# EAGLE design mainboard (EAGLE 9.6.2)
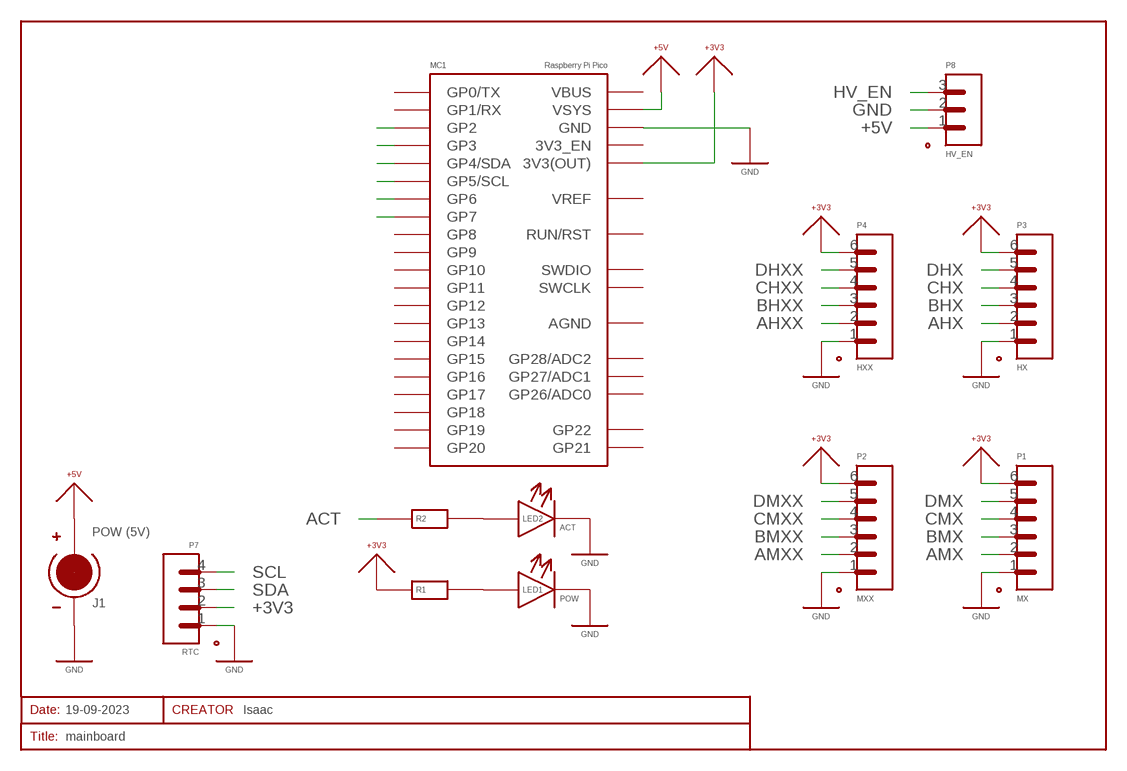
[diagram p0: schematic, sheet 1]

## Parts
CREATOR  Isaac  INFO_T  [INFO_T]
J1  POW (5V)  DC_POWER_CENTER-POS_XH2.54  [XH2.54_2-PIN]
LED1  POW  LED_3MM  [LED_3MM]
LED2  ACT  LED_3MM  [LED_3MM]
MC1  RASPBERRY-PI-PICO_THT  [RASPBERRY-PI-PICO_THT]
P1  MX  PORT_6-PIN_XH2.54  [XH2.54_6-PIN]
P2  MXX  PORT_6-PIN_XH2.54  [XH2.54_6-PIN]
P3  HX  PORT_6-PIN_XH2.54  [XH2.54_6-PIN]
P4  HXX  PORT_6-PIN_XH2.54  [XH2.54_6-PIN]
P7  RTC  PORT_4-PIN_XH2.54  [XH2.54_4-PIN]
P8  HV_EN  PORT_3-PIN_XH2.54  [XH2.54_3-PIN]
R1  RESISTOR  [RESISTOR_10.16MM]
R2  RESISTOR  [RESISTOR_10.16MM]
SCHEMATIC1  19-09-2023  SHEET  [SHEET]

## Nets
+3V3: MC1.36(3V3(OUT)) P1.6 P2.6 P3.6 P4.6 P7.2 R1.1
+5V: J1.2(+) MC1.39(VSYS) P8.1
ACT: R2.1
AHX: P3.2
AHXX: P4.2
AMX: P1.2
AMXX: P2.2
BHX: P3.3
BHXX: P4.3
BMX: P1.3
BMXX: P2.3
CHX: P3.4
CHXX: P4.4
CMX: P1.4
CMXX: P2.4
DHX: P3.5
DHXX: P4.5
DMX: P1.5
DMXX: P2.5
GND: J1.1(GND) LED1.- LED2.- MC1.3(GND) MC1.8(GND) MC1.13(GND) MC1.18(GND) MC1.23(GND) MC1.28(GND) MC1.38(GND) MC1.D_GND(GND) P1.1 P2.1 P3.1 P4.1 P7.1 P8.2
HV_EN: P8.3
N$1: LED1.+ R1.2
N$2: LED2.+ R2.2
N$3: MC1.6(GP4/SDA)
N$4: MC1.7(GP5/SCL)
N$5: MC1.4(GP2)
N$6: MC1.5(GP3)
N$7: MC1.9(GP6)
N$8: MC1.10(GP7)
SCL: P7.4
SDA: P7.3
Unconnected: MC1.1(GP0/TX) MC1.2(GP1/RX) MC1.11(GP8) MC1.12(GP9) MC1.14(GP10) MC1.15(GP11) MC1.16(GP12) MC1.17(GP13) MC1.19(GP14) MC1.20(GP15) MC1.21(GP16) MC1.22(GP17) MC1.24(GP18) MC1.25(GP19) MC1.26(GP20) MC1.27(GP21) MC1.29(GP22) MC1.30(RUN/RST) MC1.31(GP26/ADC0) MC1.32(GP27/ADC1) MC1.34(GP28/ADC2) MC1.35(VREF) MC1.37(3V3_EN) MC1.40(VBUS) MC1.SWCLK MC1.SWDIO

## Power pins joined to a net without a drawn wire
AGND: MC1.33(AGND)

## Library data of the parts
CREATOR = myLibrary:INFO
J1 = myLibrary:DC_POWER_CENTER-POS
LED1 LED2 = myLibrary:LED
MC1 = myLibrary:RASPBERRY-PI-PICO
P1-P4 = myLibrary:PORT_6-PIN
P7 = myLibrary:PORT_4-PIN
P8 = myLibrary:PORT_3-PIN
R1 R2 = myLibrary:RESISTOR
SCHEMATIC1 = myLibrary:SHEET

## Board
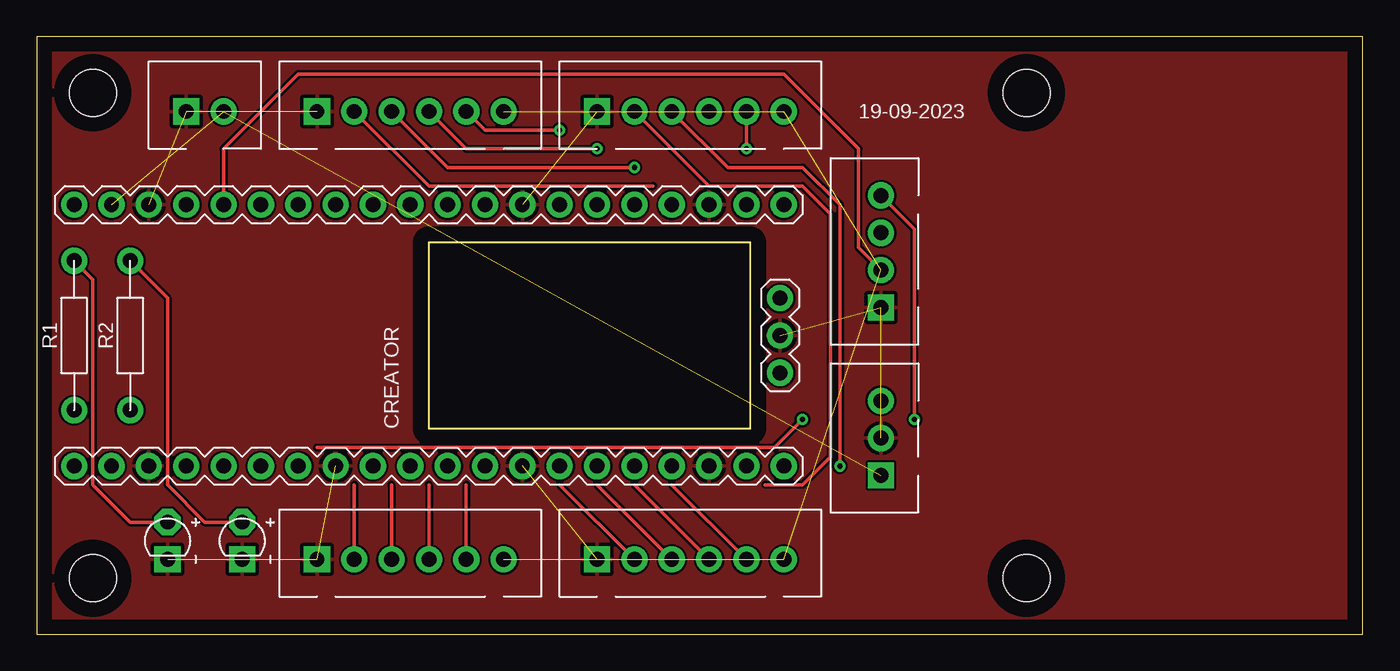
[diagram p1: board, top side]
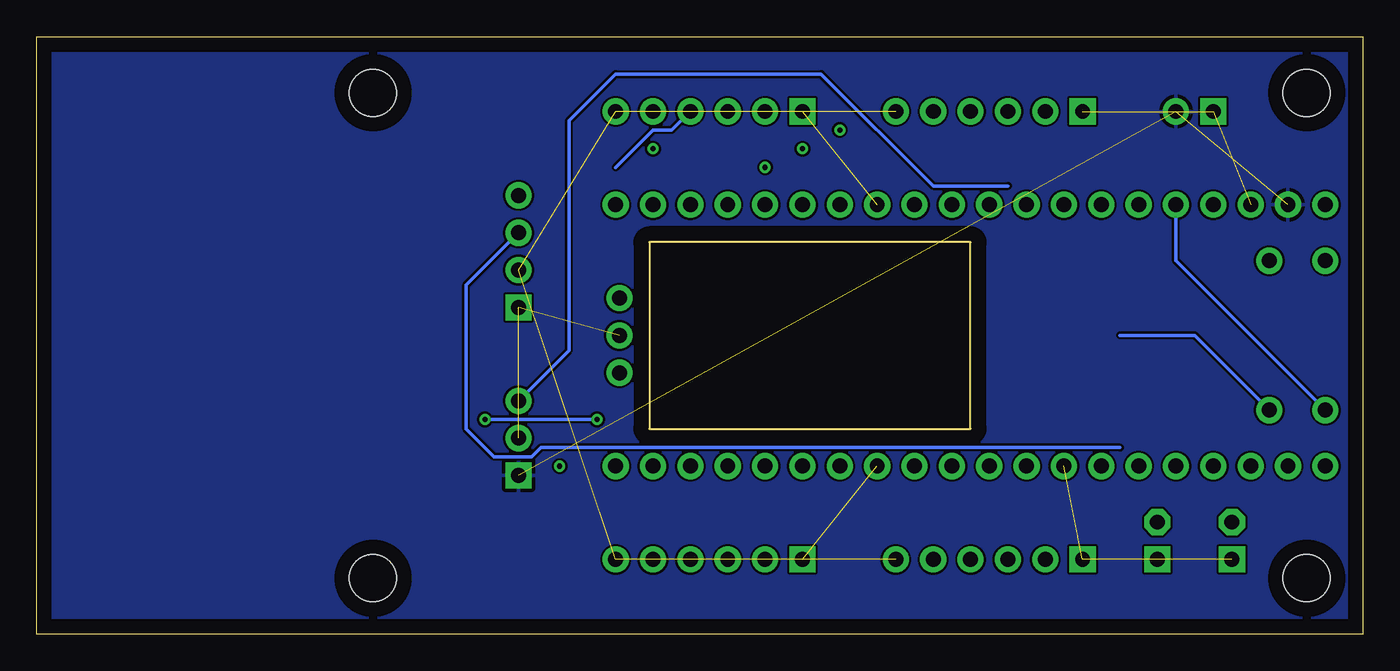
[diagram p2: board, bottom side, seen from below]

Size 90.17 x 40.64 mm. Coordinates in mm from the lower left corner, seen from the top.
Outline: 0,0 90.17,0 90.17,40.64 0,40.64 0,0
Outline: 48.51,26.67 48.51,13.97 26.67,13.97 26.67,26.67 48.51,26.67
Copper layers (1*16): Top 0.035mm / dielectric 1.5mm / Bottom 0.035mm
Design rules "default": minimum track width 6mil, minimum drill 0.35mm, track to track 6mil, track to pad 6mil, pad to pad 6mil, via to via 6mil, smd to smd 6mil, copper to edge 40mil, drill to drill 6mil, minimum pad ring 10mil, minimum via ring 8mil, stop-mask expansion 4mil, vias tented up to drill 0mil, thermal gap 10mil
Holes 3.2 mm at 3.81,36.83 3.81,3.81 67.31,3.81 67.31,36.83

### Footprints (pad centres in the part's own frame; a part is rotated, then mirrored left to right if it is on the bottom)
XH2.54_2-PIN = drill 1.016 pad 1.778 square: 1 -1.27,0 | drill 1.016 pad 1.778: 2 1.27,0
LED_3MM = drill 1.016 pad 1.778 octagon: + -1.27,0 | drill 1.016 pad 1.778 square: - 1.27,0
RASPBERRY-PI-PICO_THT = drill 1.016 pad 1.778: 1 -8.89,24.13; 2 -8.89,21.59; 3 -8.89,19.05; 4 -8.89,16.51; 5 -8.89,13.97; 6 -8.89,11.43; 7 -8.89,8.89; 8 -8.89,6.35; 9 -8.89,3.81; 10 -8.89,1.27; 11 -8.89,-1.27; 12 -8.89,-3.81; 13 -8.89,-6.35; 14 -8.89,-8.89; 15 -8.89,-11.43; 16 -8.89,-13.97; 17 -8.89,-16.51; 18 -8.89,-19.05; 19 -8.89,-21.59; 20 -8.89,-24.13; 21 8.89,-24.13; 22 8.89,-21.59; 23 8.89,-19.05; 24 8.89,-16.51; 25 8.89,-13.97; 26 8.89,-11.43; 27 8.89,-8.89; 28 8.89,-6.35; 29 8.89,-3.81; 30 8.89,-1.27; 31 8.89,1.27; 32 8.89,3.81; 33 8.89,6.35; 34 8.89,8.89; 35 8.89,11.43; 36 8.89,13.97; 37 8.89,16.51; 38 8.89,19.05; 39 8.89,21.59; 40 8.89,24.13; D_GND 0,-23.876; SWCLK -2.54,-23.876; SWDIO 2.54,-23.876
XH2.54_6-PIN = drill 1.016 pad 1.778 square: 1 -6.35,0 | drill 1.016 pad 1.778: 2 -3.81,0; 3 -1.27,0; 4 1.27,0; 5 3.81,0; 6 6.35,0
XH2.54_4-PIN = drill 1.016 pad 1.778 square: 1 -3.81,0 | drill 1.016 pad 1.778: 2 -1.27,0; 3 1.27,0; 4 3.81,0
XH2.54_3-PIN = drill 1.016 pad 1.778 square: 1 -2.54,0 | drill 1.016 pad 1.778: 2 0,0; 3 2.54,0
RESISTOR_10.16MM = drill 1.016 pad 1.778: 1 -5.08,0; 2 5.08,0

### Placement (x,y rotation side)
CREATOR  25.4,20.32 90 top
J1  11.43,35.56 0 top
LED1  8.89,6.35 270 top
LED2  13.97,6.35 270 top
MC1  26.67,20.32 90 top
P1  25.4,5.08 0 top
P2  44.45,5.08 0 top
P3  44.45,35.56 0 top
P4  25.4,35.56 0 top
P7  57.4,26.04 90 top
P8  57.4,13.34 90 top
R1  2.54,20.32 90 top
R2  6.35,20.32 90 top
SCHEMATIC1  55.88,36.83 0 top

### Tracks (layer width: path | path; a pad name or v marks a point on that pad's centre or on a via)
+3V3  (4 unrouted)
  Top 0.254: P7.2 55.88,26.29 55.88,33.02 50.8,38.1 17.78,38.1 12.7,33.02 MC1.36
  Bottom 0.254: R1.1 12.7,25.4 MC1.36
+5V  (2 unrouted)
  pour Bottom: -2.54,43.18 -2.54,-2.54 93.98,-2.54 93.98,43.18
ACT
  Bottom 0.254: R2.1 11.43,20.32 16.51,20.32
AHX
  Top 0.254: P3.2 45.72,30.48 52.07,30.48 53.98,28.57 53.98,12.06 52.07,10.16 49.53,10.16
AHXX
  Top 0.254: P4.2 26.67,30.48 41.91,30.48
AMX
  Top 0.254: 21.59,10.16 P1.2
AMXX
  Top 0.254: 35.56,10.16 P2.2
BHX  (via drill 0.35)
  Top 0.254: P3.3 46.99,31.75 52.07,31.75 54.61,29.21 v54.61,11.43
BHXX  (via drill 0.35)
  Top 0.254: P4.3 27.94,31.75 v40.64,31.75
BMX
  Top 0.254: 24.13,10.16 P1.3
BMXX
  Top 0.254: 38.1,10.16 P2.3
CHX
  Bottom 0.254: P3.4 46.99,34.29 48.26,34.29 50.8,31.75
CHXX  (via drill 0.35)
  Top 0.254: P4.4 29.21,33.02 v38.1,33.02
CMX
  Top 0.254: 26.67,10.16 P1.4
CMXX
  Top 0.254: 40.64,10.16 P2.4
DHX  (via drill 0.35)
  Top 0.254: P3.5 v48.26,33.02
DHXX  (via drill 0.35)
  Top 0.254: P4.5 30.48,34.29 v35.56,34.29
DMX
  Top 0.254: 29.21,10.16 P1.5
DMXX
  Top 0.254: 43.18,10.16 P2.5
GND  (9 unrouted)
  pour Top: -1.27,41.91 -1.27,-1.27 92.71,-1.27 92.71,41.91
HV_EN
  Bottom 0.254: P8.3 53.98,19.3 53.98,34.92 50.8,38.1 36.83,38.1 29.21,30.48 24.13,30.48
N$1
  Top 0.254: R1.2 3.81,24.13 3.81,10.16 6.35,7.62 LED1.+
N$2
  Top 0.254: R2.2 8.89,22.86 8.89,10.16 11.43,7.62 LED2.+
SCL  (via drill 0.35)
  Top 0.254: v52.07,14.61 50.16,12.7 19.05,12.7 | v59.69,14.61 59.69,27.56 P7.4
  Bottom 0.254: v52.07,14.61 v59.69,14.61
SDA
  Bottom 0.254: P7.3 60.96,23.75 60.96,13.97 59.05,12.06 56.52,12.06 55.88,12.7 16.51,12.7